# EAGLE design Amplificador_Ganho_1000_Versão2 (EAGLE 4.09)
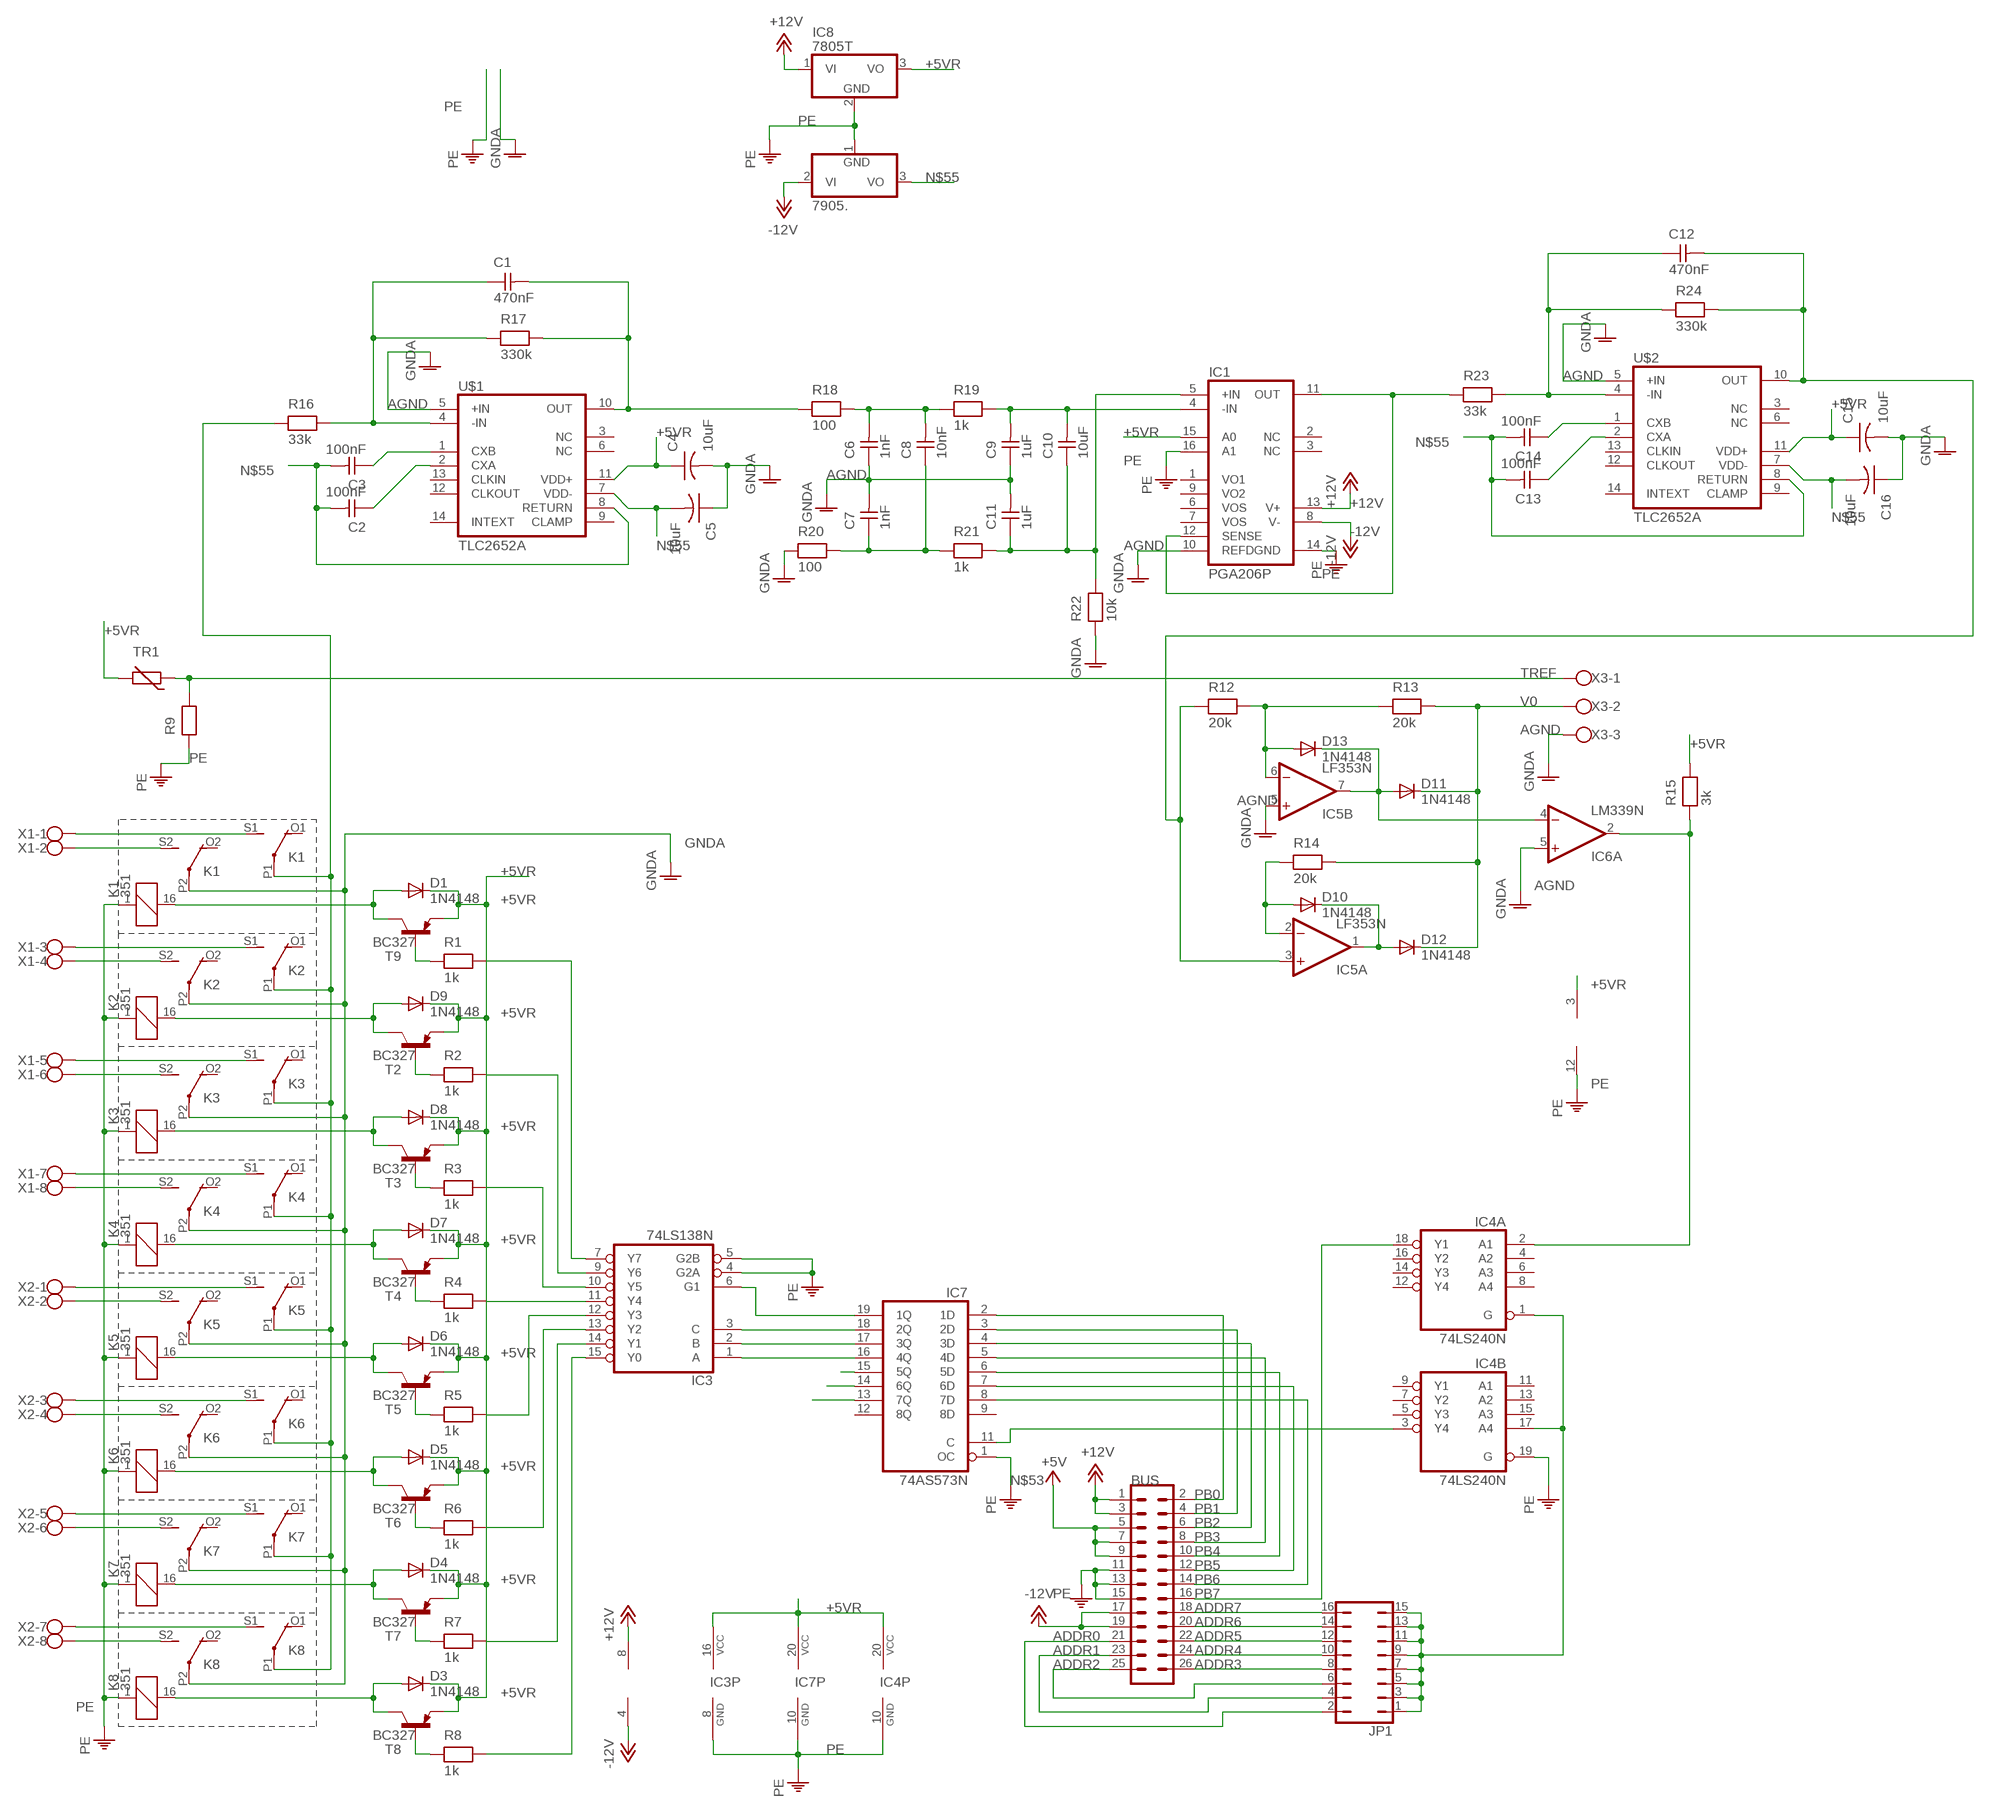
[diagram p0: schematic, sheet 1]

## Parts
7905.  7905T  [TO220H]
BUS  ML26  [ML26]
C1  470nF  CAPNP-5  [C-5]
C2  100nF  CAPNP-5  [C-5]
C3  100nF  CAPNP-5  [C-5]
C4  10uF  CAP-5  [C-5]
C5  10uF  CAP-5  [C-5]
C6  1nF  CAPNP-5  [C-5]
C7  1nF  CAPNP-5  [C-5]
C8  10nF  CAPNP-5  [C-5]
C9  1uF  CAPNP-5  [C-5]
C10  10uF  CAPNP-5  [C-5]
C11  1uF  CAPNP-5  [C-5]
C12  470nF  CAPNP-5  [C-5]
C13  100nF  CAPNP-5  [C-5]
C14  100nF  CAPNP-5  [C-5]
C15  10uF  CAP-5  [C-5]
C16  10uF  CAP-5  [C-5]
D1  1N4148  [DO35-10]
D3  1N4148  [DO35-10]
D4  1N4148  [DO35-10]
D5  1N4148  [DO35-10]
D6  1N4148  [DO35-10]
D7  1N4148  [DO35-10]
D8  1N4148  [DO35-10]
D9  1N4148  [DO35-10]
D10  1N4148  [DO35-10]
D11  1N4148  [DO35-10]
D12  1N4148  [DO35-10]
D13  1N4148  [DO35-10]
IC1  PGA206P  [DIL16]
IC3  74LS138N  [DIL16]
IC4  74LS240N  [DIL20]
IC5  LF353N  [DIL08]
IC6  LM339N  [DIL14]
IC7  74AS573N  [DIL20]
IC8  7805T  [TO220H]
JP1  JP8Q  [JP8Q]
K1  351  [351]
K2  351  [351]
K3  351  [351]
K4  351  [351]
K5  351  [351]
K6  351  [351]
K7  351  [351]
K8  351  [351]
R1  1k  RESEU-10  [R-10]
R2  1k  RESEU-10  [R-10]
R3  1k  RESEU-10  [R-10]
R4  1k  RESEU-10  [R-10]
R5  1k  RESEU-10  [R-10]
R6  1k  RESEU-10  [R-10]
R7  1k  RESEU-10  [R-10]
R8  1k  RESEU-10  [R-10]
R9  RESEU-10  [R-10]
R12  20k  RESEU-10  [R-10]
R13  20k  RESEU-10  [R-10]
R14  20k  RESEU-10  [R-10]
R15  3k  RESEU-10  [R-10]
R16  33k  RESEU-10  [R-10]
R17  330k  RESEU-10  [R-10]
R18  100  RESEU-10  [R-10]
R19  1k  RESEU-10  [R-10]
R20  100  RESEU-10  [R-10]
R21  1k  RESEU-10  [R-10]
R22  10k  RESEU-10  [R-10]
R23  33k  RESEU-10  [R-10]
R24  330k  RESEU-10  [R-10]
T2  BC327  [TO92]
T3  BC327  [TO92]
T4  BC327  [TO92]
T5  BC327  [TO92]
T6  BC327  [TO92]
T7  BC327  [TO92]
T8  BC327  [TO92]
T9  BC327  [TO92]
TR1  THERM-2,5  [RS-2,5]
U$1  TLC2652A  [DIP14]
U$2  TLC2652A  [DIP14]
X1  AK500/8  [AK500/8]
X2  AK500/8  [AK500/8]
X3  AK500/3  [AK500/3]

## Nets
+5V: BUS.5 BUS.7 BUS.9
+5VR: C4.1 C15.1 D1.C D3.C D4.C D5.C D6.C D7.C D8.C D9.C IC1.15(A0) IC3.16(VCC) IC4.20(P:VCC) IC6.3(P:V+) IC7.20(VCC) IC8.3(VO) R15.2 T2.1(E) T3.1(E) T4.1(E) T5.1(E) T6.1(E) T7.1(E) T8.1(E) T9.1(E) TR1.2 U$1.11(VDD+) U$2.11(VDD+)
+12V: BUS.1 BUS.3 IC1.13(V+) IC5.8(P:V+) IC8.1(VI)
-12V: 7905..2(VI) BUS.17 BUS.19 IC1.8(V-) IC5.4(P:V-)
ADDR0: BUS.21 JP1.2
ADDR1: BUS.23 JP1.4
ADDR2: BUS.25 JP1.6
ADDR3: BUS.26 JP1.8
ADDR4: BUS.24 JP1.10
ADDR5: BUS.22 JP1.12
ADDR6: BUS.20 JP1.14
ADDR7: BUS.18 JP1.16
AGND: C4.2 C5.1 C6.1 C7.2 C9.1 C11.2 C15.2 C16.1 IC1.10(REF) IC5.5(B:+IN) IC6.5(A:+IN) R20.1 R22.1 U$1.5(+IN) U$2.5(+IN) X3.3 ; supply symbol labelled GNDA
GNDA: K1.P2(3:P) K2.P2(3:P) K3.P2(3:P) K4.P2(3:P) K5.P2(3:P) K6.P2(3:P) K7.P2(3:P) K8.P2(3:P)
N$1: IC7.14(6Q)
N$2: R5.1 T5.2(B)
N$3: IC3.7(Y7) R1.2
N$4: IC3.9(Y6) R2.2
N$5: IC3.10(Y5) R3.2
N$6: IC3.11(Y4) R4.2
N$7: IC3.15(Y0) R8.2
N$8: IC3.14(Y1) R7.2
N$9: IC3.13(Y2) R6.2
N$10: R1.1 T9.2(B)
N$11: IC3.1(A) IC7.16(4Q)
N$12: IC3.2(B) IC7.17(3Q)
N$13: IC3.3(C) IC7.18(2Q)
N$14: IC3.6(G1) IC7.19(1Q)
N$15: D6.A K5.16 T5.3(C)
N$16: C10.1 C11.1 IC1.5(+IN) R21.2 R22.2
N$17: R2.1 T2.2(B)
N$18: D1.A K1.16 T9.3(C)
N$19: D9.A K2.16 T2.3(C)
N$20: R6.1 T6.2(B)
N$21: R3.1 T3.2(B)
N$22: D8.A K3.16 T3.3(C)
N$23: D5.A K6.16 T6.3(C)
N$24: R4.1 T4.2(B)
N$25: D7.A K4.16 T4.3(C)
N$26: R7.1 T7.2(B)
N$27: D4.A K7.16 T7.3(C)
N$28: R8.1 T8.2(B)
N$29: D3.A K8.16 T8.3(C)
N$30: IC3.12(Y3) R5.2
N$32: IC4.2(A:A1) IC6.2(A:OUT) R15.1
N$33: IC4.1(A:G) IC4.17(B:A4) JP1.1 JP1.3 JP1.5 JP1.7 JP1.9 JP1.11 JP1.13 JP1.15
N$34: IC7.13(7Q)
N$35: K1.S1(2:S) X1.1
N$36: K1.S2(3:S) X1.2
N$37: K2.S1(2:S) X1.3
N$38: K2.S2(3:S) X1.4
N$39: K3.S1(2:S) X1.5
N$40: K3.S2(3:S) X1.6
N$41: K4.S1(2:S) X1.7
N$42: K4.S2(3:S) X1.8
N$43: K5.S1(2:S) X2.1
N$44: K5.S2(3:S) X2.2
N$45: K6.S1(2:S) X2.3
N$46: K6.S2(3:S) X2.4
N$47: K7.S1(2:S) X2.5
N$48: K7.S2(3:S) X2.6
N$49: K8.S1(2:S) X2.7
N$50: K8.S2(3:S) X2.8
N$51: IC7.15(5Q)
N$52: IC1.11(OUT) IC1.12(SENSE) R23.1
N$53: IC4.3(B:Y4) IC7.11(C)
N$55: 7905..3(VO) C2.2 C3.2 C5.2 C13.2 C14.2 C16.2 U$1.7(VDD-) U$1.8(RETURN) U$2.7(VDD-) U$2.8(RETURN)
N$56: D10.A IC5.2(A:-IN) R14.1
N$57: C1.2 R17.2 R18.1 U$1.10(OUT)
N$58: D10.C D12.A IC5.1(A:OUT)
N$59: K1.P1(2:P) K2.P1(2:P) K3.P1(2:P) K4.P1(2:P) K5.P1(2:P) K6.P1(2:P) K7.P1(2:P) K8.P1(2:P) R16.1
N$60: C3.1 U$1.1(CXB)
N$62: C2.1 U$1.2(CXA)
N$63: D13.A IC5.6(B:-IN) R12.2 R13.1
N$64: D11.A D13.C IC5.7(B:OUT) IC6.4(A:-IN)
N$65: C6.2 C8.2 R18.2 R19.1
N$66: C12.2 IC5.3(A:+IN) R12.1 R24.2 U$2.10(OUT)
N$67: C1.1 R16.2 R17.1 U$1.4(-IN)
N$69: C7.1 C8.1 R20.2 R21.1
N$70: C14.1 U$2.1(CXB)
N$71: C9.2 C10.2 IC1.4(-IN) R19.2
N$73: C13.1 U$2.2(CXA)
N$74: C12.1 R23.2 R24.1 U$2.4(-IN)
PB0: BUS.2 IC7.2(1D)
PB1: BUS.4 IC7.3(2D)
PB2: BUS.6 IC7.4(3D)
PB3: BUS.8 IC7.5(4D)
PB4: BUS.10 IC7.6(5D)
PB5: BUS.12 IC7.7(6D)
PB6: BUS.14 IC7.8(7D)
PB7: BUS.16 IC4.18(A:Y1)
PE: 7905..1(GND) BUS.11 BUS.13 BUS.15 IC1.14(DGND) IC1.16(A1) IC3.4(G2A) IC3.5(G2B) IC3.8(GND) IC4.10(P:GND) IC4.19(B:G) IC6.12(P:V-) IC7.1(OC) IC7.10(GND) IC8.2(GND) K1.1 K2.1 K3.1 K4.1 K5.1 K6.1 K7.1 K8.1 R9.1
TREF: R9.2 TR1.1 X3.1
V0: D11.C D12.C R13.2 R14.2 X3.2
Unconnected: IC1.1(VO1) IC1.2(NC) IC1.3(NC) IC1.6(VOS) IC1.7(VOS) IC1.9(VO2) IC4.4(A:A2) IC4.5(B:Y3) IC4.6(A:A3) IC4.7(B:Y2) IC4.8(A:A4) IC4.9(B:Y1) IC4.11(B:A1) IC4.12(A:Y4) IC4.13(B:A2) IC4.14(A:Y3) IC4.15(B:A3) IC4.16(A:Y2) IC6.1(B:OUT) IC6.6(B:-IN) IC6.7(B:+IN) IC6.8(C:-IN) IC6.9(C:+IN) IC6.10(D:-IN) IC6.11(D:+IN) IC6.13(D:OUT) IC6.14(C:OUT) IC7.9(8D) IC7.12(8Q) K1.O1(2:O) K1.O2(3:O) K2.O1(2:O) K2.O2(3:O) K3.O1(2:O) K3.O2(3:O) K4.O1(2:O) K4.O2(3:O) K5.O1(2:O) K5.O2(3:O) K6.O1(2:O) K6.O2(3:O) K7.O1(2:O) K7.O2(3:O) K8.O1(2:O) K8.O2(3:O) U$1.3(NC) U$1.6(NC) U$1.9(CLAMP) U$1.12(CLKOUT) U$1.13(CLKIN) U$1.14(INTEXT) U$2.3(NC) U$2.6(NC) U$2.9(CLAMP) U$2.12(CLKOUT) U$2.13(CLKIN) U$2.14(INTEXT)

## Library data of the parts
7905. = linear:79*: Negative VOLTAGE REGULATOR
BUS = con-harting-ml:ML26: HARTING
C1-C3 C6-C14 = discrete:CAPNP-5
C4 C5 C15 C16 = discrete:CAP-5
D1 D3-D13 = diode:1N4148: DIODE high speed (Philips)
IC1 = burr-brown:PGA206: High-Speed Programmable Gain Instrumentation Amplifier
IC3 = 74xx-us:74*138: 3-line to 8-line DECODER/DEMULTIPLEXER
IC4 = 74xx-us:74*240: Octal BUFFER and LINE DRIVER, 3-state
IC5 = linear:LF353: OP AMP
IC6 = linear:LM339: COMPARATOR
IC7 = 74xx-us:74*573: 8-bit D latch BUS DRIVER
IC8 = linear:78*: Positive VOLTAGE REGULATOR
JP1 = jumper:JP8Q: JUMPER
K1-K8 = relay:351: RELAY 2 x switch, Omron
R1-R9 R12-R24 = discrete:RESEU-10
T2-T9 = transistor-pnp:BC327: PNP Transistor
TR1 = discrete:THERM-2,5
U$1 U$2 = ti:TLC2652A
X1 X2 = con-ptr500:AK500/8: CONNECTOR
X3 = con-ptr500:AK500/3: CONNECTOR

## Board
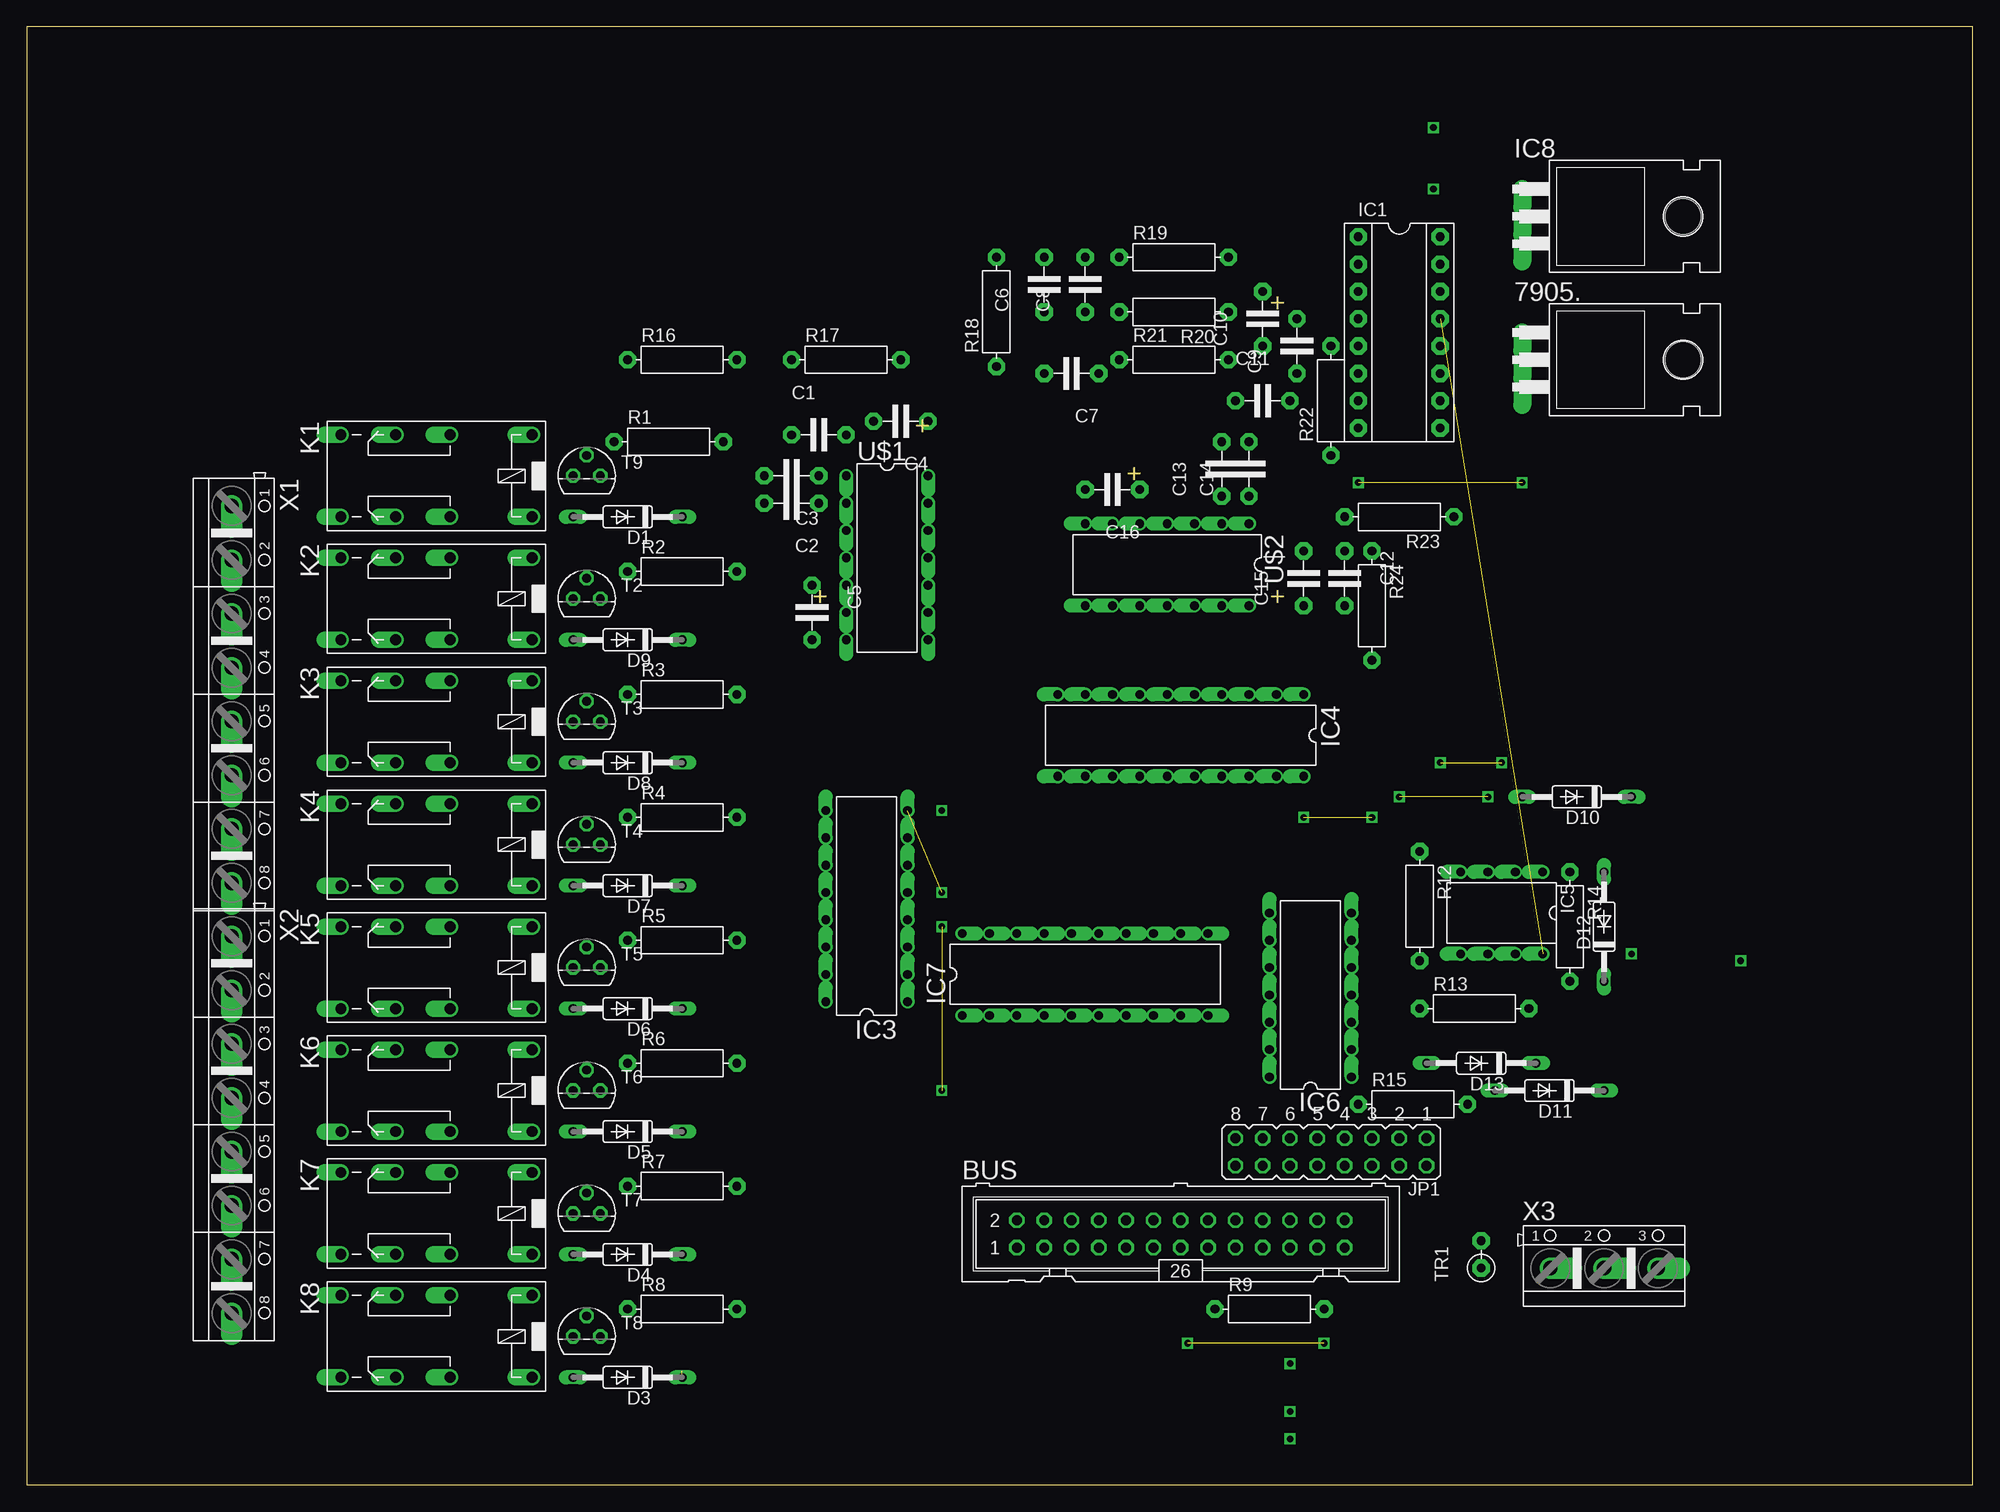
[diagram p1: board, top side]
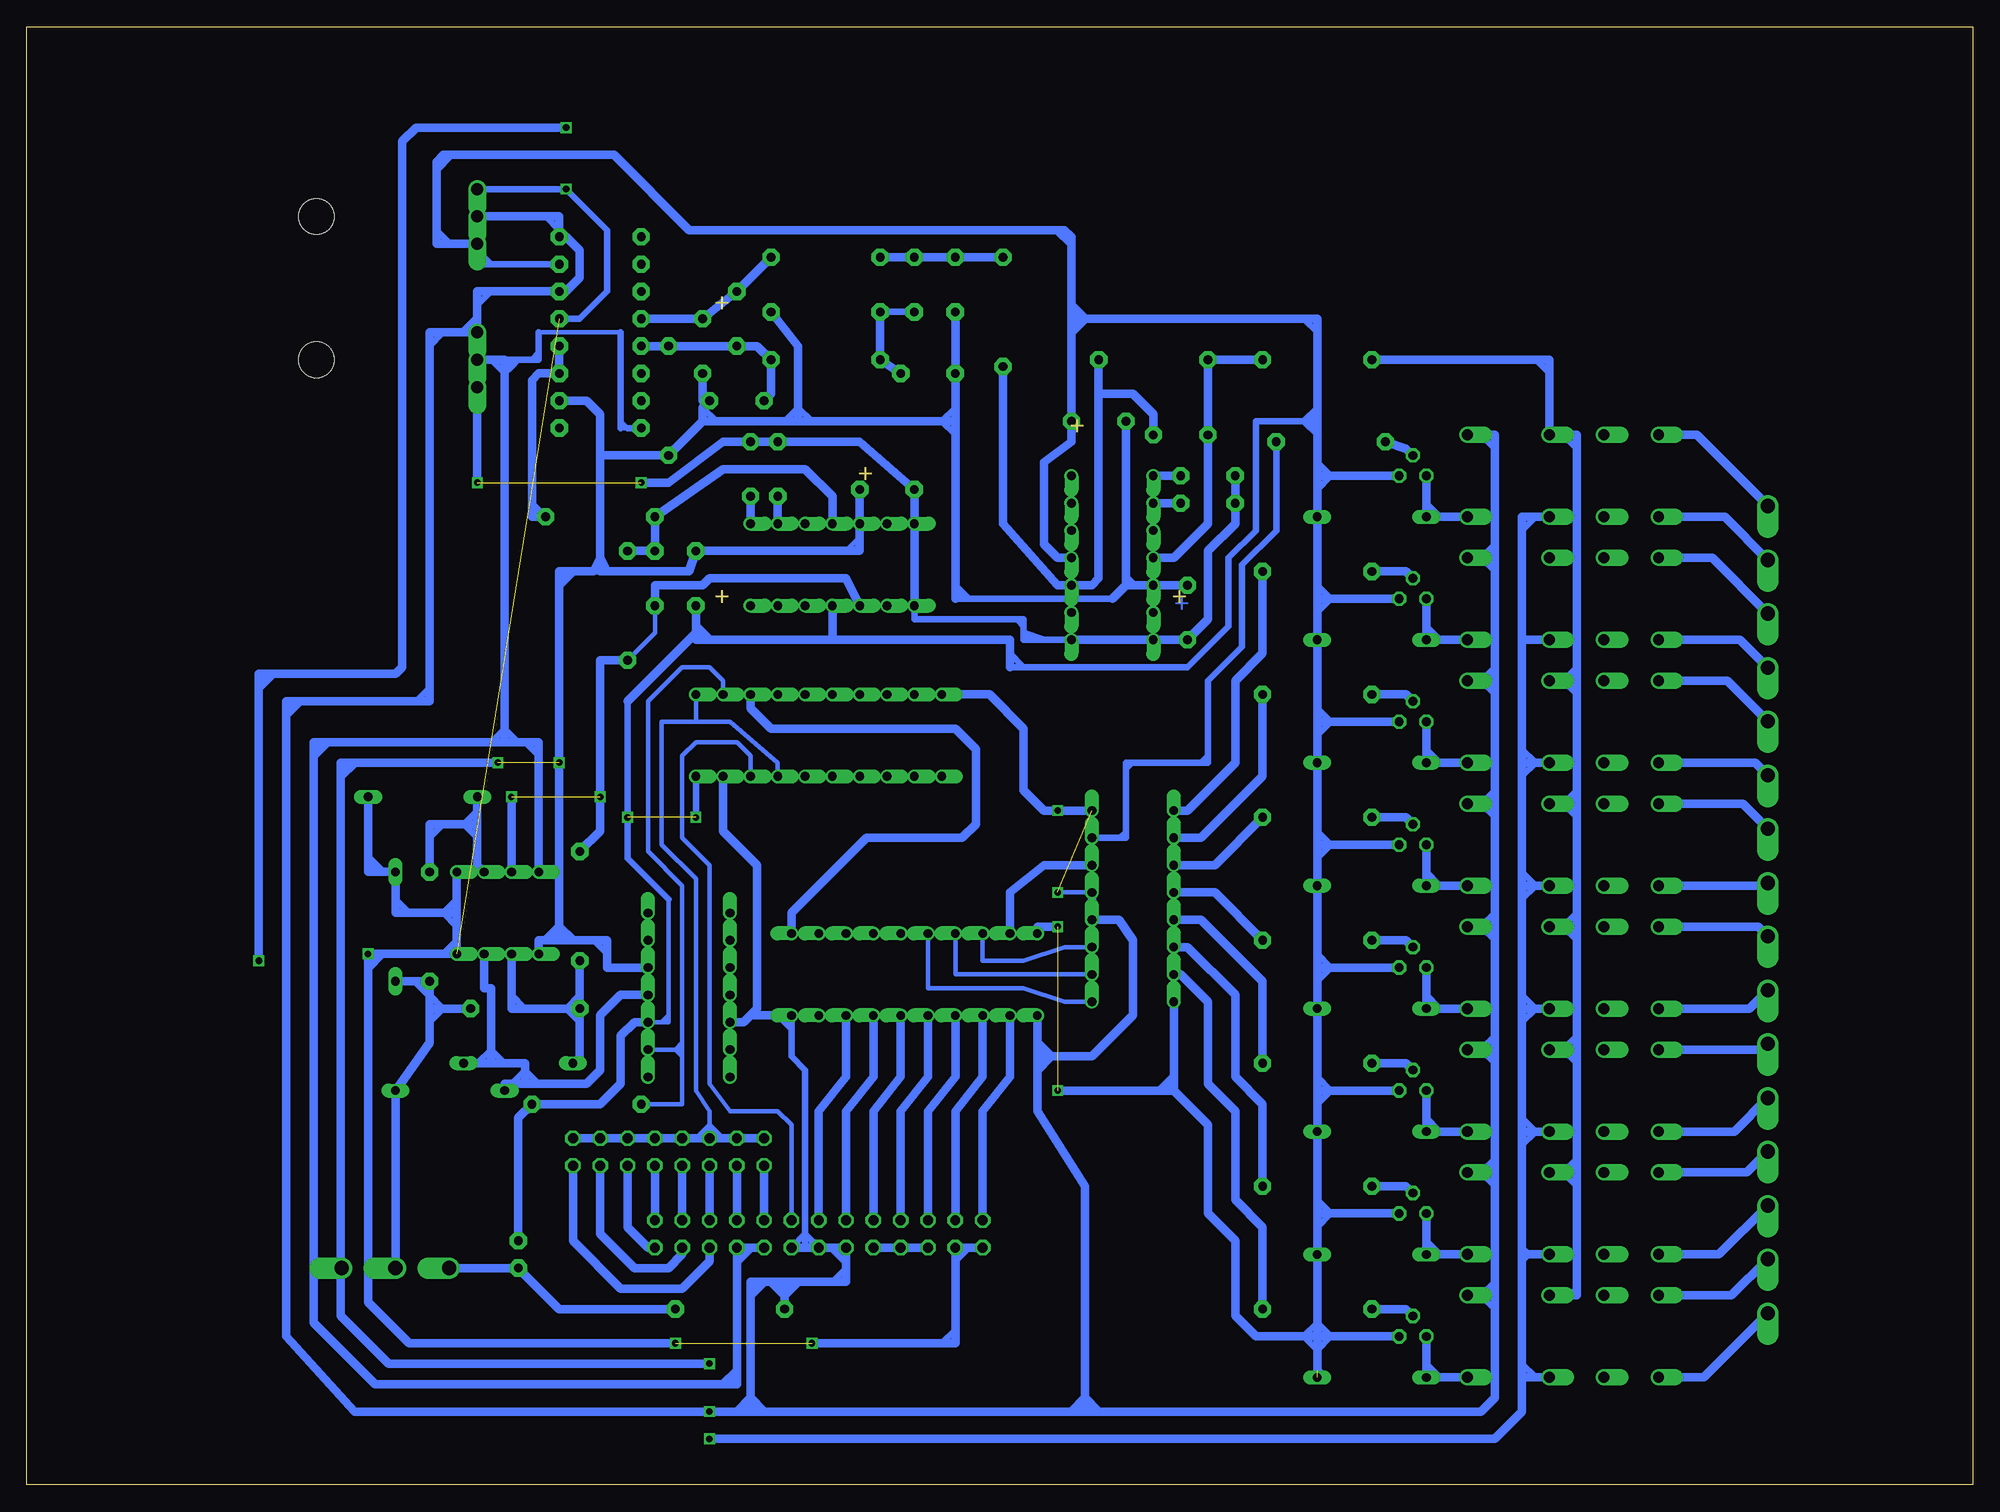
[diagram p2: board, bottom side, seen from below]

Size 180.95 x 135.56 mm. Coordinates in mm from the lower left corner, seen from the top.
Outline: 0,0 180.95,0 180.95,135.56 0,135.56 0,0
Copper layers used: Bottom

### Footprints (pad centres in the part's own frame; a part is rotated, then mirrored left to right if it is on the bottom)
TO220H = drill 1.118 offset: 1 -2.54,-10.16; 2 0,-10.16; 3 2.54,-10.16 | hole 3.302: 0,4.826
ML26 = drill 0.914 octagon: 1 -15.24,-1.27; 2 -15.24,1.27; 3 -12.7,-1.27; 4 -12.7,1.27; 5 -10.16,-1.27; 6 -10.16,1.27; 7 -7.62,-1.27; 8 -7.62,1.27; 9 -5.08,-1.27; 10 -5.08,1.27; 11 -2.54,-1.27; 12 -2.54,1.27; 13 0,-1.27; 14 0,1.27; 15 2.54,-1.27; 16 2.54,1.27; 17 5.08,-1.27; 18 5.08,1.27; 19 7.62,-1.27; 20 7.62,1.27; 21 10.16,-1.27; 22 10.16,1.27; 23 12.7,-1.27; 24 12.7,1.27; 25 15.24,-1.27; 26 15.24,1.27
C-5 = drill 0.813 pad 1.6 octagon: 1 -2.54,0; 2 2.54,0
DO35-10 = drill 0.813 long: A 5.08,0; C -5.08,0
DIL16 = drill 0.813 pad 1.6 octagon: 1 -8.89,-3.81; 2 -6.35,-3.81; 3 -3.81,-3.81; 4 -1.27,-3.81; 5 1.27,-3.81; 6 3.81,-3.81; 7 6.35,-3.81; 8 8.89,-3.81; 9 8.89,3.81; 10 6.35,3.81; 11 3.81,3.81; 12 1.27,3.81; 13 -1.27,3.81; 14 -3.81,3.81; 15 -6.35,3.81; 16 -8.89,3.81
DIL16' = drill 0.813 offset: 1 -8.89,-3.81; 2 -6.35,-3.81; 3 -3.81,-3.81; 4 -1.27,-3.81; 5 1.27,-3.81; 6 3.81,-3.81; 7 6.35,-3.81; 8 8.89,-3.81; 9 8.89,3.81; 10 6.35,3.81; 11 3.81,3.81; 12 1.27,3.81; 13 -1.27,3.81; 14 -3.81,3.81; 15 -6.35,3.81; 16 -8.89,3.81
DIL20 = drill 0.813 offset: 1 -11.43,-3.81; 2 -8.89,-3.81; 3 -6.35,-3.81; 4 -3.81,-3.81; 5 -1.27,-3.81; 6 1.27,-3.81; 7 3.81,-3.81; 8 6.35,-3.81; 9 8.89,-3.81; 10 11.43,-3.81; 11 11.43,3.81; 12 8.89,3.81; 13 6.35,3.81; 14 3.81,3.81; 15 1.27,3.81; 16 -1.27,3.81; 17 -3.81,3.81; 18 -6.35,3.81; 19 -8.89,3.81; 20 -11.43,3.81
DIL08 = drill 0.813 offset: 1 -3.81,-3.81; 2 -1.27,-3.81; 3 1.27,-3.81; 4 3.81,-3.81; 5 3.81,3.81; 6 1.27,3.81; 7 -1.27,3.81; 8 -3.81,3.81
DIL14 = drill 0.813 offset: 1 -7.62,-3.81; 2 -5.08,-3.81; 3 -2.54,-3.81; 4 0,-3.81; 5 2.54,-3.81; 6 5.08,-3.81; 7 7.62,-3.81; 8 7.62,3.81; 9 5.08,3.81; 10 2.54,3.81; 11 0,3.81; 12 -2.54,3.81; 13 -5.08,3.81; 14 -7.62,3.81
JP8Q = drill 0.914 octagon: 1 -8.89,-1.27; 2 -8.89,1.27; 3 -6.35,-1.27; 4 -6.35,1.27; 5 -3.81,-1.27; 6 -3.81,1.27; 7 -1.27,-1.27; 8 -1.27,1.27; 9 1.27,-1.27; 10 1.27,1.27; 11 3.81,-1.27; 12 3.81,1.27; 13 6.35,-1.27; 14 6.35,1.27; 15 8.89,-1.27; 16 8.89,1.27
351 = drill 1.016 offset: 1 -3.81,-3.81; 16 -3.81,3.81; O1 8.89,-3.81; O2 8.89,3.81; P1 3.81,-3.81; P2 3.81,3.81; S1 13.97,-3.81; S2 13.97,3.81
R-10 = drill 0.813 pad 1.6 octagon: 1 -5.08,0; 2 5.08,0
TO92 = drill 0.813 octagon: 1 1.27,0; 2 0,1.905; 3 -1.27,0
RS-2,5 = drill 0.813 pad 1.6 octagon: 1 0,0; 2 2.54,0
DIP14 = drill 0.813 offset: 1 -7.62,-3.81; 2 -5.08,-3.81; 3 -2.54,-3.81; 4 0,-3.81; 5 2.54,-3.81; 6 5.08,-3.81; 7 7.62,-3.81; 8 7.62,3.81; 9 5.08,3.81; 10 2.54,3.81; 11 0,3.81; 12 -2.54,3.81; 13 -5.08,3.81; 14 -7.62,3.81
AK500/8 = drill 1.321 offset: 1 -17.526,0; 2 -12.497,0; 3 -7.518,0; 4 -2.489,0; 5 2.489,0; 6 7.518,0; 7 12.497,0; 8 17.526,0
AK500/3 = drill 1.321 offset: 1 -5.004,0; 2 0,0; 3 5.004,0

### Placement (x,y rotation side)
7905.  149.22,104.61 270 top
BUS  107.31,23.33 0 top
C1  73.66,97.62 0 top
C2  71.11,91.28 180 top
C3  71.11,93.82 180 top
C4  81.28,98.9 180 top
C5  73.02,81.11 270 top
C6  94.61,111.59 90 top
C7  97.15,103.34 180 top
C8  98.42,111.59 90 top
C9  118.1,105.88 90 top
C10  114.93,108.42 90 top
C11  114.93,100.8 0 top
C12  122.55,84.29 270 top
C13  111.12,94.45 90 top
C14  113.66,94.45 90 top
C15  118.74,84.29 90 top
C16  100.96,92.55 180 top
D1  55.88,90.01 180 top
D3  55.88,10 180 top
D4  55.88,21.43 180 top
D5  55.88,32.86 180 top
D6  55.88,44.28 180 top
D7  55.88,55.72 180 top
D8  55.88,67.14 180 top
D9  55.88,78.58 180 top
D10  144.14,63.97 180 top
D11  141.6,36.67 180 top
D12  146.68,51.91 90 top
D13  135.25,39.2 180 top
IC1  127.63,107.15 270 top
IC3  74LS138N  [DIL16']  78.1,53.81 90 top
IC4  107.31,69.69 180 top
IC5  137.16,53.17 180 top
IC6  119.38,45.56 90 top
IC7  98.42,47.46 0 top
IC8  149.22,117.95 270 top
JP1  121.28,30.95 180 top
K1  43.17,93.82 180 top
K2  43.17,82.39 180 top
K3  43.17,70.95 180 top
K4  43.17,59.53 180 top
K5  43.17,48.09 180 top
K6  43.17,36.67 180 top
K7  43.17,25.23 180 top
K8  43.17,13.81 180 top
R1  59.69,96.99 0 top
R2  60.95,84.93 0 top
R3  60.95,73.5 0 top
R4  60.95,62.06 0 top
R5  60.95,50.64 0 top
R6  60.95,39.2 0 top
R7  60.95,27.78 0 top
R8  60.95,16.35 0 top
R9  115.56,16.35 0 top
R12  129.53,53.81 270 top
R13  134.62,44.28 0 top
R14  143.5,51.91 270 top
R15  128.9,35.4 0 top
R16  60.95,104.61 0 top
R17  76.19,104.61 0 top
R18  90.16,109.06 90 top
R19  106.67,114.14 0 top
R20  106.67,109.06 180 top
R21  106.67,104.61 0 top
R22  121.28,100.8 90 top
R23  127.63,90.01 180 top
R24  125.09,81.75 270 top
T2  52.06,82.39 0 top
T3  52.06,70.95 0 top
T4  52.06,59.53 0 top
T5  52.06,48.09 0 top
T6  52.06,36.67 0 top
T7  52.06,25.23 0 top
T8  52.06,13.81 0 top
T9  52.06,93.82 0 top
TR1  135.25,20.16 90 top
U$1  80,86.2 270 top
U$2  106.04,85.56 180 top
X1  19.05,73.5 270 top
X2  19.05,33.49 270 top
X3  146.68,20.16 0 top

### Tracks (layer width: path | path; a pad name or v marks a point on that pad's centre or on a via)
+5V
  Bottom 0.813: BUS.5 BUS.7 BUS.9
+5VR  (via drill 0.61)  (3 unrouted)
  Bottom 0.406: 121.91,43.02 121.28,43.02 121.28,43.65 | 121.91,43.02 IC6.3 | 121.28,54.45 121.28,43.65 | 121.28,43.65 121.91,43.02
  Bottom 0.61: 137.79,113.5 139.06,113.5 139.06,114.14 | 137.79,113.5 IC1.15 | IC8.3 139.06,114.77 | 139.06,114.77 139.06,114.14 | 125.09,72.86 v125.09,62.06 125.09,58.25 121.28,54.45 | 88.26,76.03 73.02,76.03 69.21,79.84 69.21,86.2 66.67,88.73 66.67,98.9 62.22,98.9 | 88.26,76.03 89.53,76.03 | 61.59,98.9 60.95,98.9 | 60.95,35.4 59.69,36.67 60.95,37.94 | 60.95,49.37 59.69,48.09 60.95,46.83 | 60.95,60.8 59.69,59.53 60.95,58.25 | 60.95,72.23 59.69,70.95 60.95,69.69 | 60.95,107.15 62.22,108.42 | 62.22,98.9 60.95,100.17 | 62.22,98.9 61.59,98.9 | 61.59,98.9 60.95,99.53 | 60.95,97.62 62.22,98.9 | 60.95,98.26 61.59,98.9 | 60.95,83.66 59.69,82.39 60.95,81.11 | 60.95,26.51 59.69,25.23 60.95,23.97 | 60.95,95.09 59.69,93.82 60.95,92.55 | 88.26,76.03 89.53,77.31 | 139.06,114.77 137.79,113.5 | 137.79,113.5 138.43,113.5 139.06,114.14 | 142.87,116.68 141.6,115.41 | v118.74,62.06 IC4.20 | 60.95,15.08 59.69,13.81 60.95,12.54 62.22,13.81 60.95,15.08
  Bottom 0.813: 118.74,79.84 118.74,79.21 | 118.74,79.84 C15.1 | 118.74,79.21 118.74,78.58 117.47,78.58 | 106.04,78.58 117.47,78.58 | 106.04,78.58 U$2.11 | 83.81,108.42 83.81,107.15 | 83.81,107.15 C4.1 83.81,96.99 86.36,95.09 86.36,87.47 85.08,86.2 U$1.11 | 60.95,13.81 60.95,12.54 60.95,10.63 60.32,10 | 60.95,13.81 59.69,13.81 T8.1 | 60.95,25.23 60.95,23.97 D4.C 60.95,15.08 60.95,13.81 | 60.95,25.23 59.69,25.23 T7.1 | 60.95,36.67 60.95,35.4 D5.C 60.95,26.51 60.95,25.23 | 60.95,36.67 59.69,36.67 T6.1 | 60.95,48.09 60.95,46.83 D6.C 60.95,37.94 60.95,36.67 | 60.95,48.09 59.69,48.09 T5.1 | 60.95,59.53 60.95,58.25 D7.C 60.95,49.37 60.95,48.09 | 60.95,59.53 59.69,59.53 T4.1 | 60.95,70.95 60.95,69.69 D8.C 60.95,60.8 60.95,59.53 | 60.95,70.95 59.69,70.95 T3.1 | 60.95,82.39 60.95,81.11 D9.C 60.95,72.23 60.95,70.95 | 60.95,82.39 59.69,82.39 T2.1 | 60.95,93.82 60.95,92.55 D1.C 60.95,83.66 60.95,82.39 | 60.95,93.82 59.69,93.82 T9.1 | 60.95,93.82 60.95,95.09 60.95,97.62 60.95,98.26 60.95,98.9 60.95,99.53 60.95,100.17 60.95,107.15 60.95,108.42 62.22,108.42 82.55,108.42 | 82.55,108.42 83.81,108.42 | 60.95,13.81 62.22,13.81 66.67,13.81 68.58,15.71 68.58,22.7 71.11,25.23 71.11,33.49 74.29,36.67 | 74.29,36.67 74.29,37.94 | 74.29,37.94 IC3.16 | IC6.3 124.45,43.02 125.72,41.75 125.72,37.3 127.63,35.4 R15.2 135.25,34.12 TR1.2 | IC7.20 86.99,51.91 v85.08,51.91 | 74.29,36.67 75.56,36.67 | 75.56,36.67 v85.08,36.67 | 106.04,78.58 89.53,78.58 89.53,77.31 89.53,76.03 | 83.81,108.42 83.81,109.69 | 83.81,109.69 83.81,115.41 | 83.81,115.41 83.81,116.04 84.45,116.68 85.08,116.68 | 85.08,116.68 119.38,116.68 126.36,123.66 141.6,123.66
  Bottom 0.813: 141.6,123.66 142.24,123.66 142.87,123.03 142.87,122.39 | 142.87,122.39 142.87,116.68 142.87,115.41 141.6,115.41 IC8.3 | 118.74,79.21 125.09,72.86 | 141.6,123.66 142.87,122.39 | 74.29,37.94 75.56,36.67 | 117.47,78.58 118.74,79.84 | 83.81,115.41 85.08,116.68 | 82.55,108.42 83.81,109.69 | 82.55,108.42 83.81,107.15
+12V  (via drill 0.61)  (2 unrouted)
  Bottom 0.61: 95.88,13.17 94.61,14.44 | 94.61,20.79 93.34,22.06 | IC1.13 129.53,108.42 127,110.96 127,116.68 v130.81,120.48 IC8.1
  Bottom 0.813: BUS.1 93.34,22.06 BUS.3 94.61,20.79 94.61,14.44 94.61,13.17 95.88,13.17 v107.94,13.17 | 147.95,49.37 v149.22,49.37 149.22,48.09 | 147.95,49.37 IC5.8 | 149.22,48.09 149.22,16.98 145.41,13.17 v120.64,13.17 | 149.22,48.09 147.95,49.37
-12V
  Bottom 0.406: 133.34,107.15 125.72,107.15 | 136.52,104.61 135.25,104.61 | 125.72,98.26 125.09,98.26 125.72,98.9
  Bottom 0.61: 133.34,105.25 133.34,104.61 133.98,104.61 | 133.34,105.25 133.34,107.15 | 135.25,104.61 133.98,104.61 | 125.09,98.26 IC1.8 | 125.72,107.15 125.72,98.9 125.72,98.26 | 137.79,104.61 136.52,103.34 135.88,103.98 | 135.88,103.98 135.25,104.61 | 135.25,104.61 137.16,104.61 | 136.52,104.61 135.88,103.98 | 135.25,69.05 136.52,70.32 137.79,69.05 | 134.62,69.05 133.34,67.78 | 133.98,104.61 133.34,105.25
  Bottom 0.813: 113.66,22.06 BUS.19 114.93,20.79 | 113.66,22.06 BUS.17 | 114.93,10.63 114.93,9.36 116.2,9.36 | 114.93,10.63 114.93,20.79 | 116.2,9.36 148.58,9.36 154.3,15.08 154.3,67.78 | 7905..2 137.79,104.61 137.16,104.61 136.52,104.61 136.52,103.34 136.52,70.32 136.52,69.05 | 133.34,66.51 IC5.4 | 133.34,66.51 133.34,67.14 | 154.3,67.78 154.3,69.05 153.03,69.05 | 133.34,66.51 133.34,67.78 133.34,69.05 134.62,69.05 135.25,69.05 136.52,69.05 | 153.03,69.05 137.79,69.05 136.52,69.05 | 114.93,10.63 116.2,9.36 | 114.93,20.79 113.66,22.06 | 154.3,67.78 153.03,69.05
ADDR0
  Bottom 0.813: JP1.2 130.17,22.7 125.72,18.25 120.01,18.25 117.47,20.79 BUS.21
ADDR1
  Bottom 0.813: BUS.23 120.01,21.43 121.28,20.16 124.45,20.16 127.63,23.33 JP1.4
ADDR2
  Bottom 0.813: BUS.25 123.19,22.06 125.09,23.97 JP1.6
ADDR3
  Bottom 0.813: BUS.26 JP1.8
ADDR4
  Bottom 0.813: BUS.24 JP1.10
ADDR5
  Bottom 0.813: BUS.22 JP1.12
ADDR6
  Bottom 0.813: BUS.20 JP1.14
ADDR7
  Bottom 0.813: BUS.18 JP1.16
AGND  (via drill 0.61)  (1 unrouted)
  Bottom 0.406: 94.61,82.39 94.61,83.02 | 103.5,88.1 104.77,86.83 104.13,86.83 103.5,87.47
  Bottom 0.61: 93.97,82.39 94.61,82.39 | 93.34,82.39 93.97,82.39 | 80,82.39 93.34,82.39 | 127.63,84.93 128.26,84.93 | 93.34,82.39 94.61,83.66 94.61,83.02 93.97,82.39 | 94.61,97.62 95.88,98.9 94.61,100.17 | 107.94,98.9 109.22,100.17 110.48,98.9 | 116.84,98.9 118.1,100.17 | 128.26,50.64 127,49.37 | 130.17,84.93 130.81,84.93
  Bottom 0.813: IC1.10 128.9,100.8 127.63,99.53 127.63,95.72 | C16.1 U$2.5 103.5,88.1 103.5,87.47 103.5,86.83 104.77,86.83 C15.2 119.38,84.93 127,84.93 | C5.1 U$1.5 78.1,83.66 | 78.1,83.66 78.73,84.29 | 78.73,84.29 C4.2 | 94.61,100.17 C6.1 | C9.1 118.1,100.8 C11.2 118.1,100.17 118.1,98.9 | 78.73,84.29 78.73,83.66 | 78.73,83.66 80,82.39 | 78.1,83.66 78.73,83.66 | 94.61,98.9 94.61,100.17 | 94.61,100.17 C7.2 | 109.22,98.9 107.94,98.9 95.88,98.9 94.61,98.9 | 118.1,98.9 116.84,98.9 110.48,98.9 109.22,98.9 | R20.1 109.22,105.88 109.22,100.17 109.22,98.9 | 127.63,95.72 R22.1 118.1,98.9 | IC5.5 133.34,50.64 132.71,50.64 | 150.49,67.14 151.76,67.14 151.76,65.88 | 150.49,67.14 v137.16,67.14 | 127,84.93 127.63,84.93 127.63,86.2 | 127.63,95.72 127.63,86.2 | 151.76,20.16 X3.3 | 151.76,20.16 151.76,65.88 | 151.76,20.16 151.76,15.71 147.31,11.27 v117.47,11.27 | 131.44,50.64 132.71,50.64 | 131.44,50.64 130.17,50.64 | 130.17,50.64 128.26,50.64 127,50.64 127,49.37 127,48.09 IC6.5 | 94.61,98.9 94.61,97.62 94.61,83.66 94.61,82.39 | 130.17,84.93 131.44,84.93 131.44,84.29 | 130.17,84.93 128.26,84.93 127.63,86.2 | 131.44,83.66 131.44,84.29 | 131.44,83.66 v131.44,67.14 131.44,51.91 | 151.76,65.88 150.49,67.14 | 130.81,84.93 131.44,84.29 | 127.63,86.2 127,84.93 | 131.44,51.91 131.44,50.64 | 131.44,51.91 130.17,50.64 | 131.44,51.91 132.71,50.64 | 130.17,84.93 131.44,83.66
GNDA  (via drill 0.61)
  Bottom 0.61: 41.91,11.27 40.63,10 | 41.91,22.06 41.27,21.43 41.91,20.79 | 41.91,31.59 40.63,32.86 41.91,34.12 | 41.91,45.56 40.63,44.28 41.91,43.02 | 41.91,54.45 40.63,55.72 41.91,56.98 | 41.91,65.88 40.63,67.14 41.91,68.42 | 41.91,88.73 40.63,90.01
  Bottom 0.813: 41.91,32.86 40.63,32.86 K6.P2 | 41.91,32.86 41.91,31.59 41.91,22.06 41.91,21.43 | 41.91,21.43 41.27,21.43 K7.P2 | 41.91,21.43 41.91,20.79 41.91,11.27 41.91,10 | 41.91,10 40.63,10 K8.P2 | 41.91,44.28 40.63,44.28 K5.P2 | 41.91,44.28 41.91,43.02 41.91,34.12 41.91,32.86 | K4.P2 40.63,55.72 41.91,55.72 | 41.91,55.72 41.91,54.45 41.91,45.56 41.91,44.28 | 41.91,67.14 40.63,67.14 K3.P2 | 41.91,55.72 41.91,56.98 41.91,65.88 41.91,67.14 | 41.91,78.58 K2.P2 | 41.91,67.14 41.91,68.42 41.91,78.58 | K1.P2 40.63,90.01 41.91,90.01 41.91,88.73 41.91,78.58 | 41.91,10 41.91,6.82 44.45,4.28 v117.47,4.28
N$2
  Bottom 0.813: R5.1 52.7,50.64 T5.2
N$3
  Bottom 0.406: 78.73,66.51 78.1,67.14 | 78.73,60.8 79.37,60.16
  Bottom 0.61: IC3.7 79.37,60.16 78.73,60.16 78.73,60.8 78.73,66.51 78.73,67.14 78.1,67.14 71.75,67.14 | 71.75,67.14 71.11,67.14 71.11,67.78 | R1.2 64.77,88.73 67.94,85.56 67.94,77.94 71.11,74.77 71.11,67.78 | 71.75,67.14 71.11,67.78
N$4
  Bottom 0.813: IC3.9 73.02,62.7 68.58,67.14 68.58,74.77 66.03,77.31 R2.2
N$5
  Bottom 0.813: IC3.10 71.75,60.16 66.03,65.88 R3.2
N$6
  Bottom 0.813: IC3.11 70.48,57.62 R4.2
N$7
  Bottom 0.813: R8.2 66.03,23.97 68.58,26.51 68.58,34.76 71.11,37.3 71.11,44.92 73.66,47.46 IC3.15
N$8
  Bottom 0.813: R7.2 66.03,35.4 68.58,37.94 68.58,45.56 73.02,50 IC3.14
N$9
  Bottom 0.813: IC3.13 71.75,52.54 66.03,46.83 R6.2
N$10
  Bottom 0.813: R1.1 52.7,96.36 T9.2
N$11
  Bottom 0.406: IC7.16 97.15,46.19 88.26,46.19 84.45,44.92 IC3.1
N$12
  Bottom 0.406: IC3.2 94.61,47.46 IC7.17
N$13
  Bottom 0.406: IC7.18 92.07,48.73 88.26,48.73 84.45,50 IC3.3
N$14
  Bottom 0.813: IC3.6 86.36,57.62 89.53,55.08 IC7.19
N$15
  Bottom 0.61: 50.8,45.56 49.52,44.28
  Bottom 0.813: T5.3 50.8,45.56 D6.A 49.52,44.28 K5.16
N$16
  Bottom 0.813: C11.1 111.75,101.44 R21.2 113.03,105.88 C10.1 R22.2 IC1.5
N$17
  Bottom 0.813: R2.1 52.7,84.93 T2.2
N$18
  Bottom 0.61: 49.52,90.01 50.8,91.28
  Bottom 0.813: T9.3 50.8,91.28 D1.A 49.52,90.01 K1.16
N$19
  Bottom 0.61: 49.52,78.58 50.8,79.84
  Bottom 0.813: T2.3 50.8,79.84 D9.A 49.52,78.58 K2.16
N$20
  Bottom 0.813: R6.1 52.7,39.2 T6.2
N$21
  Bottom 0.813: R3.1 52.7,73.5 T3.2
N$22
  Bottom 0.61: 49.52,67.14 50.8,68.42
  Bottom 0.813: T3.3 50.8,68.42 D8.A 49.52,67.14 K3.16
N$23
  Bottom 0.61: 50.8,34.12 49.52,32.86
  Bottom 0.813: K6.16 49.52,32.86 D5.A 50.8,34.12 T6.3
N$24
  Bottom 0.813: R4.1 52.7,62.06 T4.2
N$25
  Bottom 0.61: 49.52,55.72 50.8,56.98
  Bottom 0.813: T4.3 50.8,56.98 D7.A 49.52,55.72 K4.16
N$26
  Bottom 0.813: R7.1 52.7,27.78 T7.2
N$27
  Bottom 0.61: 50.8,22.7 49.52,21.43
  Bottom 0.813: T7.3 50.8,22.7 D4.A 49.52,21.43 K7.16
N$28
  Bottom 0.813: R8.1 52.7,16.35 T8.2
N$29
  Bottom 0.61: 50.8,11.27 49.52,10
  Bottom 0.813: T8.3 50.8,11.27 D3.A 49.52,10 K8.16
N$30
  Bottom 0.813: IC3.12 70.48,55.08 R5.2
N$31  (via drill 0.61)
  Bottom 0.813: v130.81,126.2 144.77,126.2 146.05,124.93 146.05,76.03 146.68,75.4 158.11,75.4 | 158.11,75.4 158.75,75.4 | 158.11,75.4 159.38,75.4 159.38,74.13 | v159.38,48.73 159.38,74.13 | 159.38,74.13 158.11,75.4
N$32
  Bottom 0.406: IC4.2 116.2,74.77 117.47,76.03 120.01,76.03 123.19,72.86 123.19,58.89 120.01,55.72 120.01,41.11 | 120.01,40.48 120.01,41.11 | 120.01,39.84 120.01,35.4 R15.1 | 120.01,39.84 120.01,40.48 | 120.01,40.48 120.64,40.48 | 120.64,40.48 IC6.2 | 120.64,40.48 120.01,41.11 | 120.01,39.84 120.64,40.48
N$33
  Bottom 0.406: 118.74,70.95 IC4.1 | 118.74,70.95 120.01,70.95 | 117.47,32.86 JP1.11 | 117.47,33.49 117.47,32.86 | 117.47,33.49 117.47,34.76 118.74,36.67 118.74,56.35 121.91,59.53 121.91,70.95 118.74,70.95 | 118.74,70.95 115.56,70.95 111.12,67.14 IC4.17 | 117.47,33.49 118.1,32.86 | 118.1,32.86 118.74,32.22 | 116.2,32.22 117.47,33.49 | 116.84,32.22 117.47,32.86 | 117.47,32.86 118.1,32.86
  Bottom 0.813: JP1.3 JP1.1 | JP1.3 127,32.22 | JP1.3 JP1.5 JP1.7 JP1.9 118.74,32.22 JP1.11 116.84,32.22 116.2,32.22 JP1.13 JP1.15
N$35
  Bottom 0.813: X1.1 25.65,97.62 K1.S1
N$36
  Bottom 0.813: X1.2 23.06,90.01 K1.S2
N$37
  Bottom 0.813: X1.3 24.23,86.2 K2.S1
N$38
  Bottom 0.813: X1.4 21.64,78.58 K2.S2
N$39
  Bottom 0.813: X1.5 22.8,74.77 K3.S1
N$40
  Bottom 0.813: X1.6 20.21,67.14 K3.S2
N$41
  Bottom 0.813: X1.7 21.38,63.34 K4.S1
N$42
  Bottom 0.813: X1.8 19.3,55.72 K4.S2
N$43
  Bottom 0.813: X2.1 19.93,51.91 K5.S1
N$44
  Bottom 0.813: X2.2 20.75,44.28 K5.S2
N$45
  Bottom 0.813: X2.3 19.58,40.48 K6.S1
N$46
  Bottom 0.813: X2.4 22.17,32.86 K6.S2
N$47
  Bottom 0.813: X2.5 21,29.05 K7.S1
N$48
  Bottom 0.813: X2.6 23.59,21.43 K7.S2
N$49
  Bottom 0.813: X2.7 22.42,17.62 K8.S1
N$50
  Bottom 0.813: X2.8 25.01,10 K8.S2
N$52
  Bottom 0.61: R23.1 133.98,91.28 133.98,90.64 133.34,90.01
  Bottom 0.813: IC1.12 IC1.11 133.34,103.34 133.98,102.7 133.98,91.28 133.98,90.01 133.34,90.01 R23.1
N$53
  Bottom 0.813: IC4.3 113.66,72.23 111.75,70.32 94.61,70.32 92.7,68.42 92.7,61.43 93.97,60.16 102.86,60.16 109.85,53.17 IC7.11
N$55  (via drill 0.61)  (1 unrouted)
  Bottom 0.61: U$1.8 86.36,78.58 | 86.36,78.58 88.26,78.58 88.26,79.21 | 88.26,79.21 88.26,79.84 | 88.26,79.84 88.26,80.48 88.89,80.48 | 88.89,80.48 98.42,80.48 U$2.8 | 86.36,78.58 88.26,79.21 | 88.26,79.84 88.89,80.48
  Bottom 0.813: 115.56,96.99 114.3,96.99 | 115.56,96.99 116.2,96.99 121.28,93.18 v123.82,93.18 | C3.2 C2.2 68.58,89.37 71.11,86.83 71.11,80.48 C5.2 U$1.7 U$1.8 | 98.42,90.01 U$2.7 | 98.42,90.01 C16.2 103.5,96.99 C13.2 C14.2 115.56,96.99 | 98.42,90.01 98.42,88.1 | U$2.8 98.42,90.01 | v139.06,93.18 7905..3
N$56
  Bottom 0.61: 139.06,60.16 140.33,61.43 139.06,62.7 | 142.24,61.43 143.5,60.16
  Bottom 0.813: 139.06,60.16 139.06,62.7 D10.A | R14.1 143.5,60.16 143.5,61.43 142.24,61.43 140.33,61.43 139.06,61.43 139.06,60.16 | 139.06,60.16 139.06,57.62 IC5.2
N$57
  Bottom 0.813: C1.2 76.19,99.53 78.1,101.44 81.28,101.44 | 81.28,101.44 81.28,84.29 81.91,83.66 U$1.10 85.08,83.66 90.16,89.37 R18.1 | 81.28,101.44 R17.2
N$58
  Bottom 0.61: 140.97,50.64 142.24,49.37 | 145.41,53.17 146.68,54.45 | 140.97,54.45 142.24,53.17 140.97,51.91
  Bottom 0.813: 147.95,56.98 D12.A 146.68,54.45 146.68,53.17 145.41,53.17 142.24,53.17 140.97,53.17 | 147.95,56.98 149.22,56.98 149.22,58.25 | 149.22,58.25 D10.C | 147.31,49.37 142.24,49.37 140.97,49.37 140.97,50.64 140.97,51.91 140.97,53.17 | 140.97,53.17 140.97,54.45 IC5.1 | 147.95,56.98 149.22,58.25
N$59
  Bottom 0.61: 36.82,18.25 37.46,17.62 | 36.82,30.32 38.09,29.05 36.82,27.78 | 36.82,39.2 38.09,40.48 36.82,41.75 | 36.82,50.64 38.09,51.91 36.82,53.17 | 36.82,64.61 38.09,63.34 36.82,62.06 | 36.82,73.5 38.09,74.77 36.82,76.03 | 36.82,96.36 38.09,97.62 | 39.36,103.34 40.63,104.61
  Bottom 0.813: 36.82,63.34 36.82,64.61 36.82,73.5 36.82,74.77 | 36.82,51.91 36.82,53.17 36.82,62.06 36.82,63.34 | 36.82,51.91 36.82,50.64 36.82,41.75 36.82,40.48 | 36.82,40.48 36.82,39.2 36.82,30.32 36.82,29.05 | 36.82,29.05 36.82,27.78 36.82,18.25 36.82,17.62 37.46,17.62 K8.P1 | 36.82,74.77 36.82,76.03 36.82,86.2 | 36.82,86.2 36.82,96.36 36.82,97.62 38.09,97.62 K1.P1 39.36,103.34 39.36,104.61 40.63,104.61 R16.1 | 36.82,86.2 K2.P1 | 36.82,74.77 38.09,74.77 K3.P1 | 36.82,40.48 38.09,40.48 K6.P1 | 36.82,29.05 38.09,29.05 K7.P1 | K5.P1 38.09,51.91 36.82,51.91 | 36.82,63.34 38.09,63.34 K4.P1
N$60
  Bottom 0.813: C3.1 U$1.1
N$62
  Bottom 0.813: C2.1 U$1.2
N$63
  Bottom 0.61: 134.62,44.28 135.88,45.56 | 129.53,45.56 130.81,44.28 129.53,43.02
  Bottom 0.813: R13.1 129.53,45.56 R12.2 | R13.1 130.81,44.28 134.62,44.28 135.88,44.28 135.88,45.56 IC5.6 | R13.1 129.53,43.02 129.53,39.2 D13.A
N$64
  Bottom 0.61: 139.06,39.2 137.79,40.48 136.52,39.2 | 133.34,37.3 134.62,38.57 135.88,37.3
  Bottom 0.813: IC6.4 125.72,45.56 127.63,43.65 127.63,38.57 128.9,37.3 133.34,37.3 134.62,37.3 | 134.62,37.3 135.88,37.3 136.52,37.3 D11.A | 137.79,39.2 139.06,39.2 D13.C | 137.79,39.2 137.79,40.48 137.79,46.19 138.43,46.19 IC5.7 | 137.79,39.2 136.52,39.2 134.62,39.2 134.62,38.57 134.62,37.3
N$65
  Bottom 0.813: R18.2 C6.2 C8.2 R19.1
N$66  (via drill 0.61)  (1 unrouted)
  Bottom 0.406: R24.2 122.55,79.21 C12.2
  Bottom 0.813: U$2.10 104.77,84.29 117.47,84.29 118.1,83.66 122.55,83.66 C12.2 | R24.2 127.63,76.67 v127.63,63.97 127.63,60.8 R12.1 | IC5.3 v135.88,63.97
N$67
  Bottom 0.813: U$1.4 74.29,86.2 71.11,89.37 C1.1 71.11,98.9 R17.1 R16.2
N$69
  Bottom 0.61: R20.2 C8.1
  Bottom 0.813: C7.1 R21.1 R20.2
N$70
  Bottom 0.813: U$2.1 C14.1
N$71
  Bottom 0.813: R19.2 C10.2 C9.2 IC1.4
N$73
  Bottom 0.813: U$2.2 C13.1
N$74
  Bottom 0.813: R24.1 C12.1 R23.2 116.2,94.45 108.58,94.45 106.04,91.91 U$2.4
PB0
  Bottom 0.813: BUS.2 92.07,34.76 89.53,37.94 IC7.2
PB1
  Bottom 0.813: BUS.4 94.61,34.76 92.07,37.94 IC7.3
PB2
  Bottom 0.813: BUS.6 97.15,34.76 94.61,37.94 IC7.4
PB3
  Bottom 0.813: BUS.8 99.69,34.76 97.15,37.94 IC7.5
PB4
  Bottom 0.813: BUS.10 102.23,34.76 99.69,37.94 IC7.6
PB5
  Bottom 0.813: BUS.12 104.77,34.76 102.23,37.94 IC7.7
PB6
  Bottom 0.813: BUS.14 107.31,34.76 104.77,37.94 IC7.8
PB7
  Bottom 0.406: BUS.16 109.85,33.49 111.12,34.76 115.56,34.76 117.47,37.3 117.47,57.62 120.01,60.16 120.01,67.78 118.74,69.05 114.93,69.05 113.66,67.78 IC4.18
PE  (via drill 0.61)  (1 unrouted)
  Bottom 0.406: IC3.5 v85.08,55.08
  Bottom 0.61: 108.58,22.06 108.58,23.33 | 108.58,23.33 108.58,38.57 109.85,39.84 109.85,42.38 | 44.45,18.89 45.72,17.62 44.45,16.35 | 44.45,27.78 45.72,29.05 44.45,30.32 | 44.45,39.2 45.72,40.48 44.45,41.75 | 44.45,50.64 45.72,51.91 44.45,53.17 | 44.45,62.06 45.72,63.34 44.45,64.61 | 44.45,73.5 45.72,74.77 44.45,76.03 | 44.45,84.93 45.72,86.2 44.45,87.47 | 44.45,96.36 45.72,97.62 | 106.04,18.89 104.77,20.16 | 107.94,22.06 107.94,22.7 108.58,23.33 | 108.58,23.33 BUS.15 | 131.44,116.68 132.71,117.95 | 139.06,109.69 137.79,110.96 | 143.5,105.88 142.24,107.15 | 144.77,72.86 143.5,74.13 | 109.85,42.38 IC7.10 | 109.85,42.38 111.12,43.65
  Bottom 0.813: 106.04,22.06 BUS.11 104.77,20.79 | 106.04,22.06 BUS.13 107.94,22.06 108.58,22.06 BUS.15 | K1.1 45.72,97.62 44.45,97.62 44.45,96.36 44.45,87.47 44.45,86.2 | 44.45,86.2 45.72,86.2 K2.1 | 44.45,74.77 45.72,74.77 K3.1 | 44.45,74.77 44.45,76.03 44.45,84.93 44.45,86.2 | 44.45,63.34 45.72,63.34 K4.1 | 44.45,63.34 44.45,64.61 44.45,73.5 44.45,74.77 | 44.45,51.91 45.72,51.91 K5.1 | 44.45,51.91 44.45,53.17 44.45,62.06 44.45,63.34 | 44.45,40.48 45.72,40.48 K6.1 | 44.45,51.91 44.45,50.64 44.45,41.75 44.45,40.48 | 44.45,29.05 45.72,29.05 K7.1 | 44.45,40.48 44.45,39.2 44.45,30.32 44.45,29.05 | 44.45,17.62 45.72,17.62 K8.1 | 44.45,29.05 44.45,27.78 44.45,18.89 44.45,17.62 | 111.12,43.65 IC7.10 113.66,43.65 | 104.77,20.79 104.77,20.16 104.77,18.89 106.04,18.89 109.22,18.89 | 113.66,43.65 114.3,43.02 IC6.12 | 137.79,110.96 IC1.14 130.81,110.96 129.53,112.23 129.53,114.77 130.81,116.04 IC1.16 131.44,116.68 131.44,117.95 132.71,117.95 IC8.2 | 44.45,17.62 44.45,16.35 44.45,8.09 45.72,6.82 81.28,6.82 | 81.28,6.82 82.55,6.82 | 82.55,6.82 83.81,6.82 | 83.81,6.82 95.25,6.82 | 95.25,6.82 95.88,6.82 | 137.79,110.96 139.06,110.96 139.06,109.69 139.06,108.42 | 137.79,110.96 136.52,110.96 | 139.06,108.42 7905..1 140.33,107.15 | 95.25,6.82 112.39,6.82 | 112.39,6.82 113.66,6.82 | 113.66,6.82 114.93,6.82 | 114.93,6.82 v117.47,6.82 150.49,6.82 156.84,13.81 156.84,71.59 | 155.57,72.86 156.84,72.86 156.84,71.59 | 155.57,72.86 144.77,72.86 143.5,72.86 143.5,74.13 143.5,105.88 143.5,107.15 142.24,107.15 140.33,107.15 | 110.48,18.89 110.48,17.62 | 110.48,17.62 R9.1 | 110.48,18.89 109.22,18.89 | 113.66,6.82 113.66,8.09 | 113.66,8.09 113.66,17.62
  Bottom 0.813: 113.66,17.62 113.66,18.89 112.39,18.89 | 112.39,18.89 111.75,18.89 | 111.75,18.89 110.48,18.89 | 113.66,8.09 114.93,6.82 | 112.39,6.82 113.66,8.09 | 110.48,17.62 109.22,18.89 | 111.75,18.89 110.48,17.62 | 113.66,17.62 112.39,18.89 | 104.77,20.79 106.04,22.06 | 140.33,107.15 139.06,108.42 | 156.84,71.59 155.57,72.86 | IC4.10 91.44,73.5 88.26,70.32 88.26,64.61 86.36,62.7 v85.08,62.7 IC3.8 | 82.55,8.09 82.55,27.78 86.99,34.76 86.99,38.57 | 82.55,6.82 82.55,8.09 | 81.28,6.82 82.55,8.09 | 82.55,8.09 83.81,6.82 | IC4.19 116.2,60.8 113.03,57.62 113.03,44.28 113.66,43.65 | 86.99,38.57 86.99,39.84 | 86.99,39.84 86.99,41.11 | 86.99,41.11 IC7.1 | 86.99,39.84 85.72,39.84 | 85.72,39.84 81.91,39.84 78.1,43.65 78.1,50.64 79.37,52.54 IC3.4 IC3.5 | 86.99,38.57 85.72,39.84 | 85.72,39.84 86.99,41.11
TREF
  Bottom 0.813: R9.2 131.44,16.35 TR1.1 X3.1
V0
  Bottom 0.61: 143.5,45.56 142.24,44.28 143.5,43.02
  Bottom 0.813: R14.2 144.14,46.83 | 143.5,44.28 142.24,44.28 R13.2 | 143.5,44.28 143.5,45.56 | 143.5,45.56 R14.2 | 143.5,44.28 143.5,43.02 143.5,41.11 D11.C X3.2 | R14.2 144.77,46.83 | 144.77,46.83 D12.C | 143.5,45.56 144.77,46.83

### Text on the board
Bottom: +
Dimension: + | + | + | + | +